# Altium schematic sheet Gyroscope.SchDoc
size A4; SheetNumber: 1; SheetTotal: 1
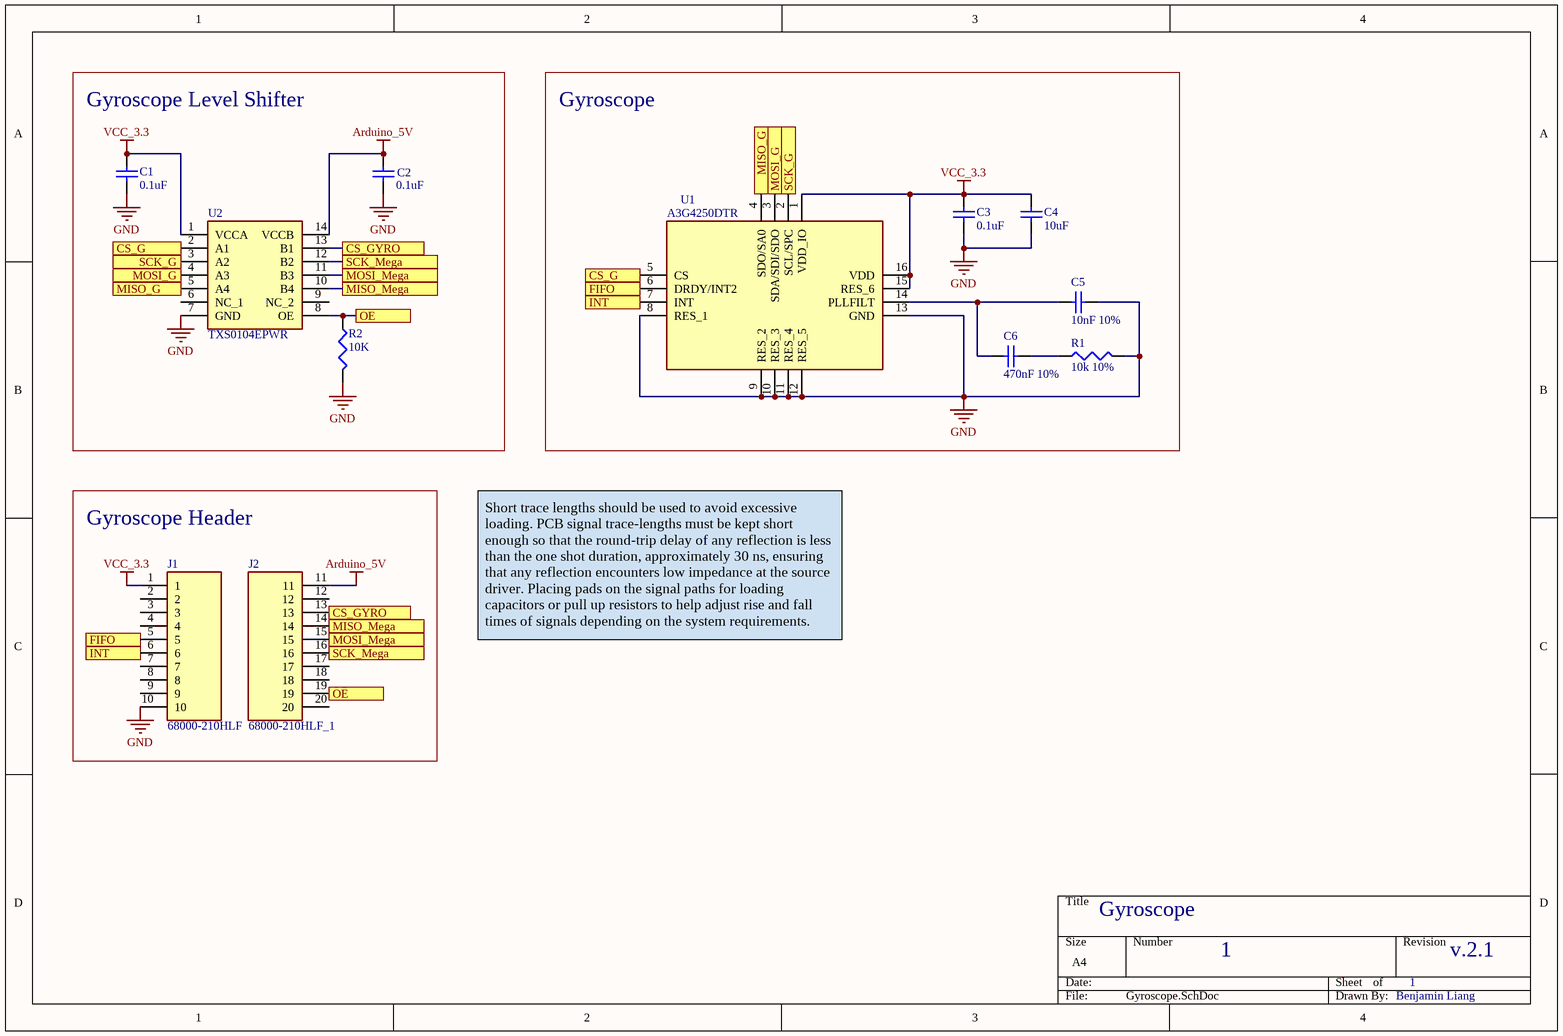
[diagram p0: Gyroscope.SchDoc]

## Parts
C1  0.1uF  [C1206]
C2  0.1uF  [C1206]
C3  0.1uF  [C1206]
C4  10uF  [C1206]
C5  10nF 10%  [C1206]
C6  470nF 10%  [C1206]
J1  68000-210HLF  [HDRV10W63P0X254_1X10_2540X241X858P]
J2  68000-210HLF_1  [HDRV10W63P0X254_1X10_2540X241X858P]
R1  10k 10%  [J1-0603]
R2  10K  [J1-0603]
U1  A3G4250DTR  [LGA-16L(4X4X1.1MM)]
U2  TXS0104EPWR  [SOP65P640X120-14N]

## Blocks framed on the sheet
Gyroscope Level Shifter: C1 C2 R2 U2
Gyroscope: C3-C6 R1 U1
Gyroscope Header: J1 J2

## Ports
CS_G, CS_GYRO, FIFO, INT, MISO_G, MISO_Mega, MOSI_G, MOSI_Mega, OE, SCK_G, SCK_Mega

## Nets
Arduino_5V: C2.1 J2.11 U2.14(VCCB)
GND: C1.2 C2.2 C3.2 C4.2 C5.2 J1.10 R1.2 R2.2 U1.8(RES_1) U1.9(RES_2) U1.10(RES_3) U1.11(RES_4) U1.12(RES_5) U1.13(GND) U2.7(GND)
VCC_3.3: C1.1 C3.1 C4.1 J1.1 U1.1(VDD_IO) U1.15(RES_6) U1.16(VDD) U2.1(VCCA)
CS_G: U1.5(CS) U2.2(A1) ; port CS_G
CS_GYRO: J2.13 U2.13(B1) ; port CS_GYRO
FIFO: J1.5 U1.6(DRDY/INT2) ; port FIFO
INT: J1.6 U1.7(INT) ; port INT
MISO_G: U1.4(SDO/SA0) U2.5(A4) ; port MISO_G
MISO_Mega: J2.14 U2.10(B4) ; port MISO_Mega
MOSI_G: U1.3(SDA/SDI/SDO) U2.4(A3) ; port MOSI_G
MOSI_Mega: J2.15 U2.11(B3) ; port MOSI_Mega
OE: J2.19 R2.1 U2.8(OE) ; port OE
SCK_G: U1.2(SCL/SPC) U2.3(A2) ; port SCK_G
SCK_Mega: J2.16 U2.12(B2) ; port SCK_Mega
NetC5_1: C5.1 C6.1 U1.14(PLLFILT)
NetC6_2: C6.2 R1.1

Not connected (* = marked no-connect by the designer): J1 2 3 4 7 8 9; J2 12 17 18 20; U2 6(NC_1) 9(NC_2)

## Notes on the sheet
- Short trace lengths should be used to avoid excessive loading. PCB signal trace-lengths must be kept short enough so that the round-trip delay of any reflection is less than the one shot duration, approximately 30 ns, ensuring that any reflection encounters low impedance at the source driver. Placing pads on the signal paths for loading capacitors or pull up resistors to help adjust rise and fall times of signals depending on the system requirements.
- Gyroscope
- 1
- v.2.1
- Benjamin Liang

## Library data of the parts
C1-C6 = Cap Semi: Capacitor (Semiconductor SIM Model); Value: 100nF; Published: 8-Jun-2000; LatestRevisionDate: 29-May-2009; LatestRevisionNote: IPC-7351 Footprint Added.; PackageReference: C1206; Publisher: Altium Limited; PackageDescription: Chip Capacitor
J1 = 68000-210HLF: Connector; Manufacturer_Name: Amphenol; Datasheet Link: https://cdn.amphenol-icc.com/media/wysiwyg/files/drawing/68000.pdf; Height: 8.58mm; Manufacturer_Part_Number: 68000-210HLF; Mouser Part Number: 649-68000-210HLF; Mouser Price/Stock: https://www.mouser.co.uk/ProductDetail/Amphenol-FCI/68000-210HLF?qs=QKvFUfBIyQINb7f%2F4SDc2A%3D%3D; Arrow Part Number: 68000-210HLF; Arrow Price/Stock: https://www.arrow.com/en/products/68000-210hlf/amphenol-fci
J2 = 68000-210HLF_1: Connector; Manufacturer_Name: Amphenol; Datasheet Link: https://cdn.amphenol-icc.com/media/wysiwyg/files/drawing/68000.pdf; Height: 8.58mm; Manufacturer_Part_Number: 68000-210HLF; Mouser Part Number: 649-68000-210HLF; Mouser Price/Stock: https://www.mouser.co.uk/ProductDetail/Amphenol-FCI/68000-210HLF?qs=QKvFUfBIyQINb7f%2F4SDc2A%3D%3D; Arrow Part Number: 68000-210HLF; Arrow Price/Stock: https://www.arrow.com/en/products/68000-210hlf/amphenol-fci
R1 = Res3: Resistor; Value: 220; Published: 8-Jun-2000; LatestRevisionDate: 29-May-2009; LatestRevisionNote: IPC-7351 Footprint Added.; PackageReference: J1-0603; Publisher: Altium Limited; PackageDescription: Chip Resistor
R2 = Res3: Resistor; Published: 8-Jun-2000; LatestRevisionDate: 29-May-2009; LatestRevisionNote: IPC-7351 Footprint Added.; PackageReference: J1-0603; Publisher: Altium Limited; PackageDescription: Chip Resistor; Value: 10K
U1 = A3G4250DTR: Integrated Circuit; Manufacturer_Name: STMicroelectronics; Datasheet Link: https://www.st.com/resource/en/datasheet/a3g4250d.pdf; Manufacturer_Part_Number: A3G4250DTR; Mouser Part Number: 511-A3G4250DTR; Mouser Price/Stock: https://www.mouser.co.uk/ProductDetail/STMicroelectronics/A3G4250DTR/?qs=Ld7sMN6XJzCU8%252BkHd1RE7g%3D%3D; Arrow Part Number: A3G4250DTR; Arrow Price/Stock: https://www.arrow.com/en/products/a3g4250dtr/stmicroelectronics
U2 = TXS0104EPWR: Integrated Circuit; Manufacturer_Name: Texas Instruments; Datasheet Link: http://www.ti.com/lit/ds/symlink/txs0104e.pdf; Height: 1.2mm; Manufacturer_Part_Number: TXS0104EPWR; Mouser Part Number: 595-TXS0104EPWR; Mouser Price/Stock: https://www.mouser.co.uk/ProductDetail/Texas-Instruments/TXS0104EPWR?qs=7kv20MEVUlglsv2MH6ZndA%3D%3D; Arrow Part Number: TXS0104EPWR; Arrow Price/Stock: https://www.arrow.com/en/products/txs0104epwr/texas-instruments?region=nac